# Altium project Power_Ctrl_Board.PrjPcb
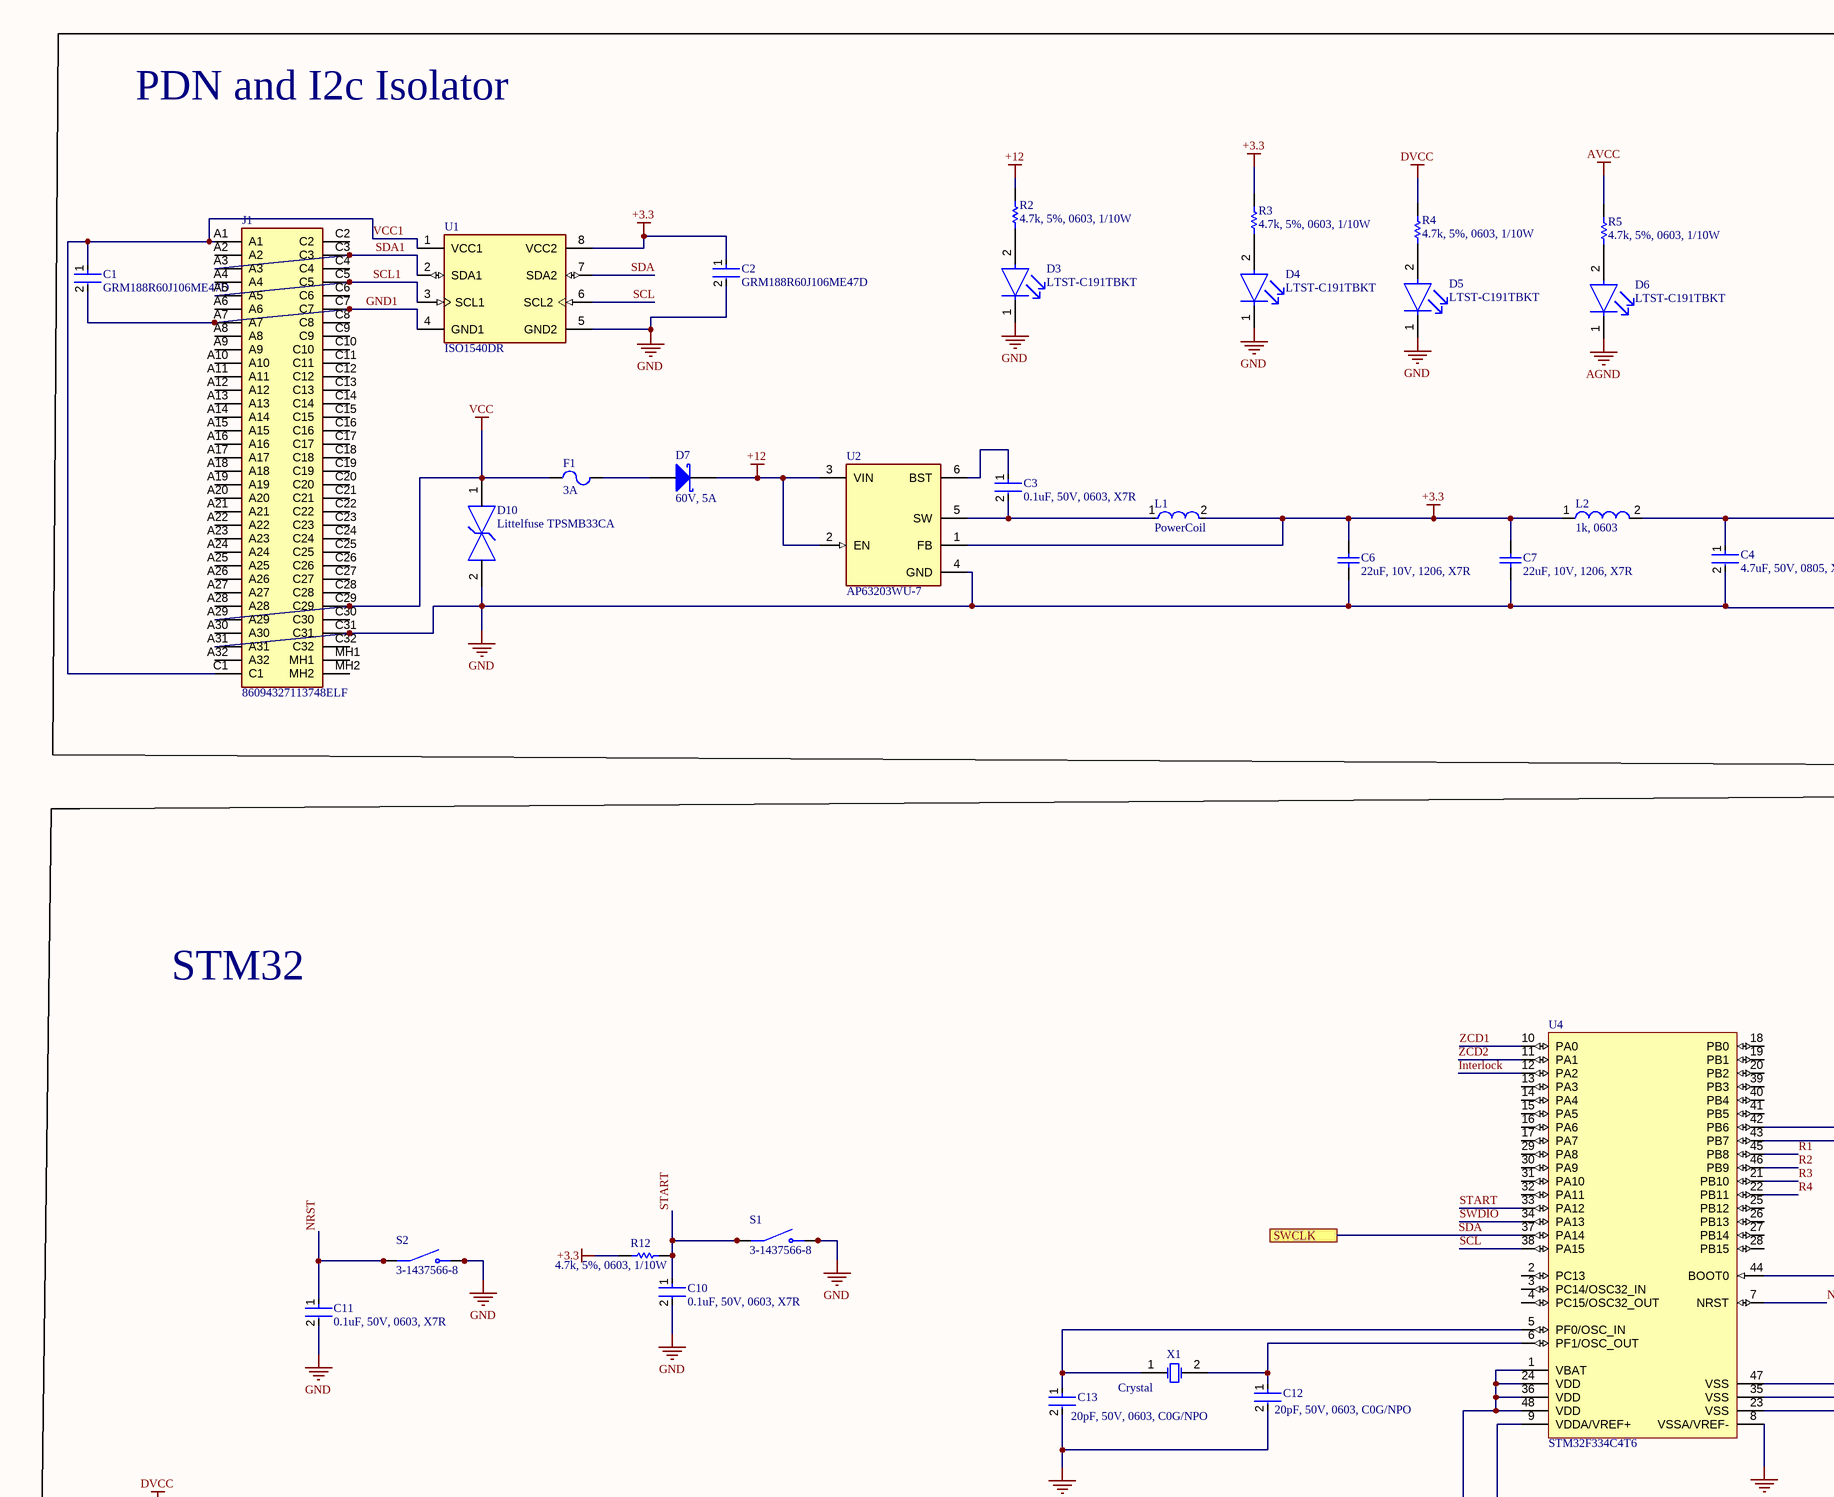
[diagram p0: Power_Ctrl_Board_SCH.SchDoc, top left]
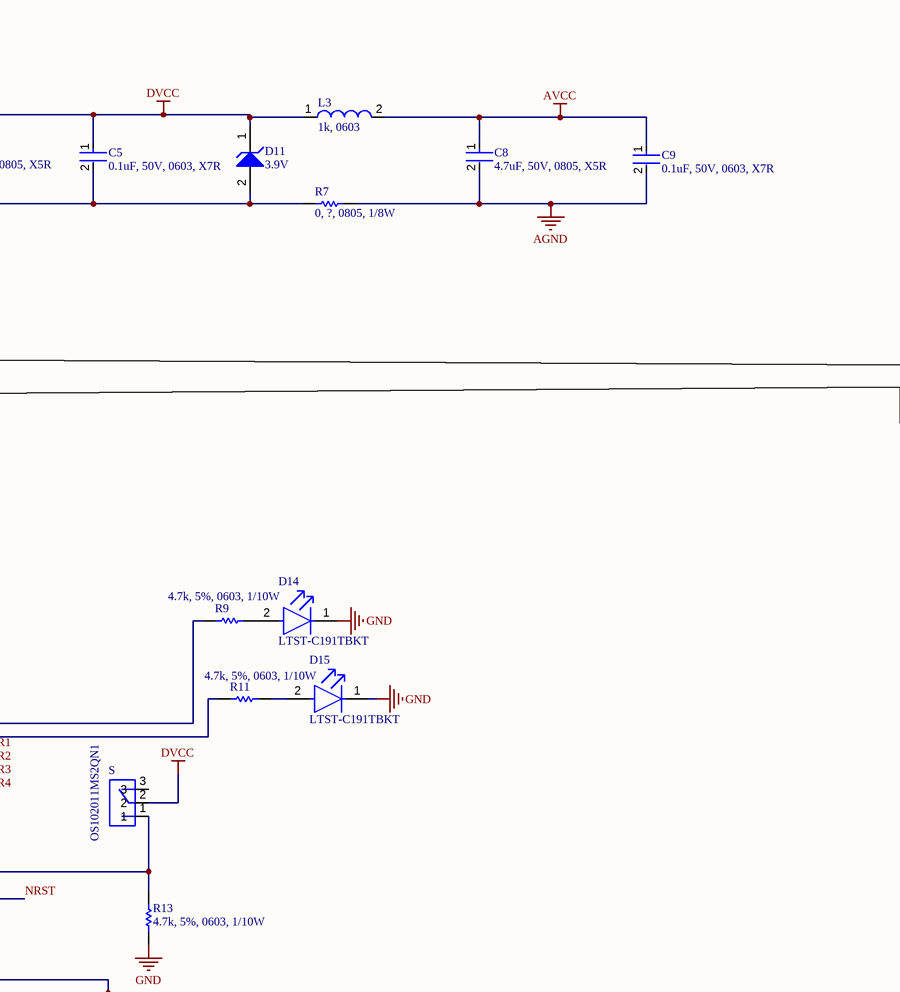
[diagram p1: Power_Ctrl_Board_SCH.SchDoc, top middle]
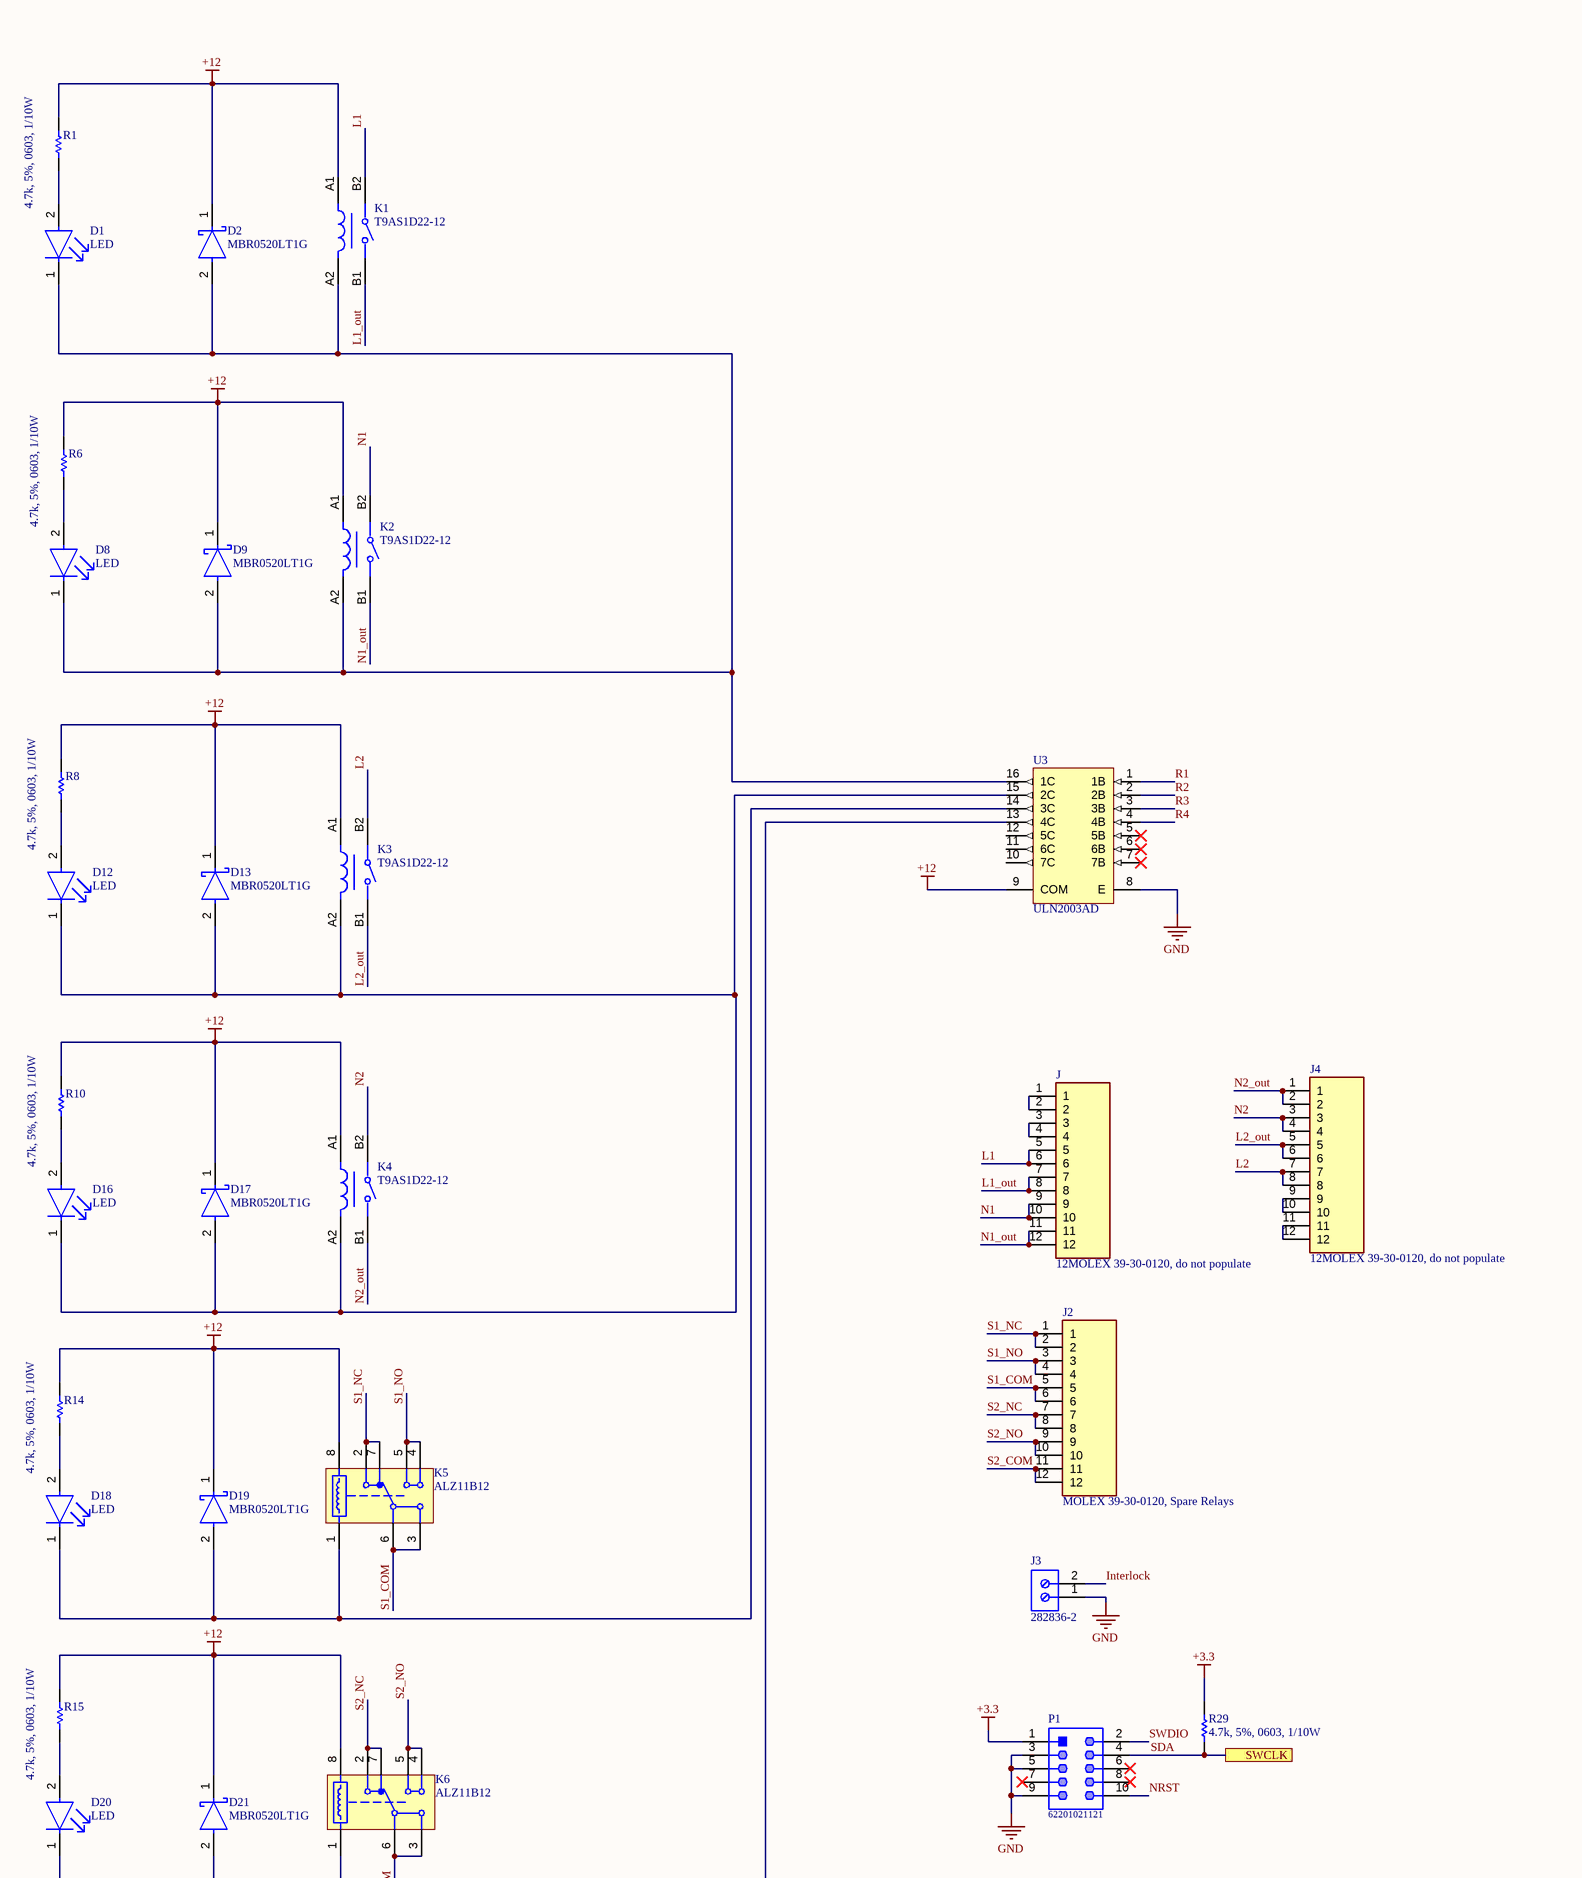
[diagram p2: Power_Ctrl_Board_SCH.SchDoc, top right]
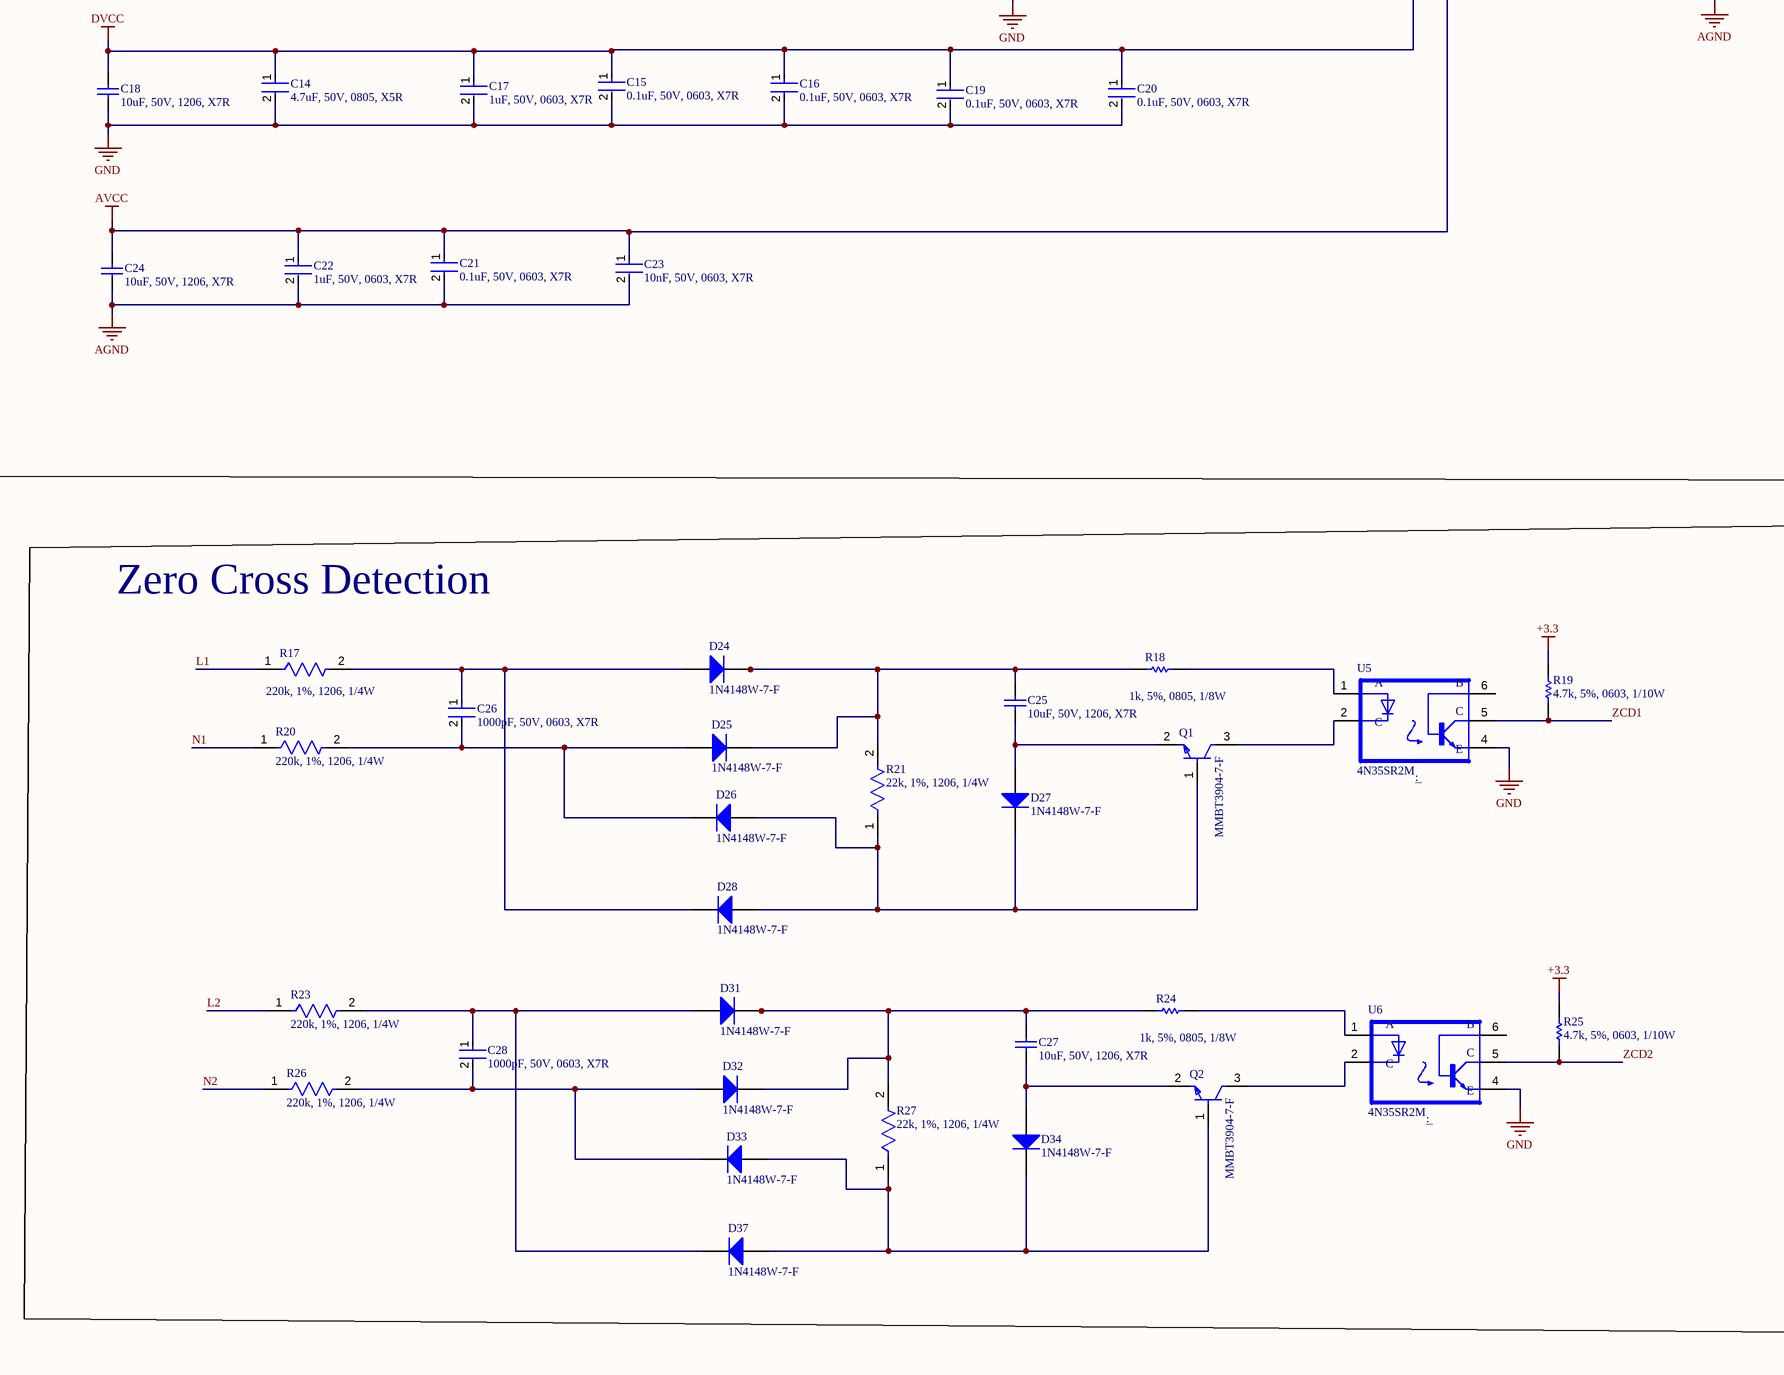
[diagram p3: Power_Ctrl_Board_SCH.SchDoc, bottom left]
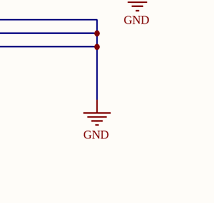
[diagram p4: Power_Ctrl_Board_SCH.SchDoc, bottom middle]
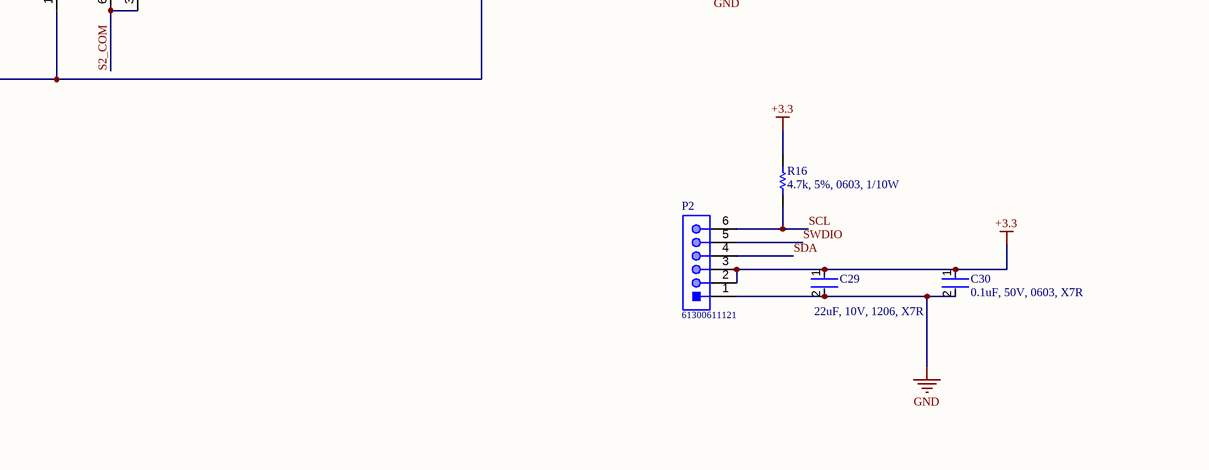
[diagram p5: Power_Ctrl_Board_SCH.SchDoc, bottom right]
1 sheet, 117 parts. Net scope: flat (ports and power ports of the same name join across sheets).
Board file: Power_Ctrl_Board_PCB.PcbDoc

## Sheet Power_Ctrl_Board_SCH.SchDoc
size 863 x 558 mm; SheetNumber: 1; SheetTotal: 1

### Parts
C1  GRM188R60J106ME47D  [FP-GRM188-0_1-e0_2_0_55-IPC_A]
C2  GRM188R60J106ME47D  [FP-GRM188-0_1-e0_2_0_55-IPC_A]
C3  0.1uF, 50V, 0603, X7R  [FP-GRM188-0_1-e0_2_0_55-IPC_A]
C4  4.7uF, 50V, 0805, X5R  [FP-C0805C-DG-MFG]
C5  0.1uF, 50V, 0603, X7R  [FP-GRM188-0_1-e0_2_0_55-IPC_A]
C6  22uF, 10V, 1206, X7R  [AVX-1206-2_L]
C7  22uF, 10V, 1206, X7R  [AVX-1206-2_L]
C8  4.7uF, 50V, 0805, X5R  [FP-C0805C-DG-MFG]
C9  0.1uF, 50V, 0603, X7R  [FP-GRM188-0_1-e0_2_0_55-IPC_A]
C10  0.1uF, 50V, 0603, X7R  [FP-GRM188-0_1-e0_2_0_55-IPC_A]
C11  0.1uF, 50V, 0603, X7R  [FP-GRM188-0_1-e0_2_0_55-IPC_A]
C12  20pF, 50V, 0603, C0G/NPO  [FP-GRM188-0_1-e0_2_0_55-IPC_A]
C13  20pF, 50V, 0603, C0G/NPO  [FP-GRM188-0_1-e0_2_0_55-IPC_A]
C14  4.7uF, 50V, 0805, X5R  [FP-C0805C-DG-MFG]
C15  0.1uF, 50V, 0603, X7R  [FP-GRM188-0_1-e0_2_0_55-IPC_A]
C16  0.1uF, 50V, 0603, X7R  [FP-GRM188-0_1-e0_2_0_55-IPC_A]
C17  1uF, 50V, 0603, X7R  [FP-GRM188-0_1-e0_2_0_55-IPC_A]
C18  10uF, 50V, 1206, X7R  [AVX-1206-2_L]
C19  0.1uF, 50V, 0603, X7R  [FP-GRM188-0_1-e0_2_0_55-IPC_A]
C20  0.1uF, 50V, 0603, X7R  [FP-GRM188-0_1-e0_2_0_55-IPC_A]
C21  0.1uF, 50V, 0603, X7R  [FP-GRM188-0_1-e0_2_0_55-IPC_A]
C22  1uF, 50V, 0603, X7R  [FP-GRM188-0_1-e0_2_0_55-IPC_A]
C23  10nF, 50V, 0603, X7R  [FP-GRM188-0_1-e0_2_0_55-IPC_A]
C24  10uF, 50V, 1206, X7R  [AVX-1206-2_L]
C25  10uF, 50V, 1206, X7R  [AVX-1206-2_L]
C26  1000pF, 50V, 0603, X7R  [FP-GRM188-0_1-e0_2_0_55-IPC_A]
C27  10uF, 50V, 1206, X7R  [AVX-1206-2_L]
C28  1000pF, 50V, 0603, X7R  [FP-GRM188-0_1-e0_2_0_55-IPC_A]
C29  22uF, 10V, 1206, X7R  [FP-GRM188-0_1-e0_2_0_55-IPC_A]
C30  0.1uF, 50V, 0603, X7R  [FP-GRM188-0_1-e0_2_0_55-IPC_A]
D1  LED  [FP-LTST-C191TBKT-MFG]
D2  MBR0520LT1G  [FP-425-04-IPC_C]
D3  LTST-C191TBKT  [FP-LTST-C191TBKT-MFG]
D4  LTST-C191TBKT  [FP-LTST-C191TBKT-MFG]
D5  LTST-C191TBKT  [FP-LTST-C191TBKT-MFG]
D6  LTST-C191TBKT  [FP-LTST-C191TBKT-MFG]
D7  60V, 5A  [NXP-SOD128_V]
D8  LED  [FP-LTST-C191TBKT-MFG]
D9  MBR0520LT1G  [FP-425-04-IPC_C]
D10  Littelfuse TPSMB33CA  [FP-SMAJ-CA-MFG]
D11  3.9V  [ONSC-SOD-123-2-425-04_V]
D12  LED  [FP-LTST-C191TBKT-MFG]
D13  MBR0520LT1G  [FP-425-04-IPC_C]
D14  LTST-C191TBKT  [FP-LTST-C191TBKT-MFG]
D15  LTST-C191TBKT  [FP-LTST-C191TBKT-MFG]
D16  LED  [FP-LTST-C191TBKT-MFG]
D17  MBR0520LT1G  [FP-425-04-IPC_C]
D18  LED  [FP-LTST-C191TBKT-MFG]
D19  MBR0520LT1G  [FP-425-04-IPC_C]
D20  LED  [FP-LTST-C191TBKT-MFG]
D21  MBR0520LT1G  [FP-425-04-IPC_C]
D24  1N4148W-7-F  [DIOD-SOD123-2_V]
D25  1N4148W-7-F  [DIOD-SOD123-2_V]
D26  1N4148W-7-F  [DIOD-SOD123-2_V]
D27  1N4148W-7-F  [DIOD-SOD123-2_V]
D28  1N4148W-7-F  [DIOD-SOD123-2_V]
D31  1N4148W-7-F  [DIOD-SOD123-2_V]
D32  1N4148W-7-F  [DIOD-SOD123-2_V]
D33  1N4148W-7-F  [DIOD-SOD123-2_V]
D34  1N4148W-7-F  [DIOD-SOD123-2_V]
D37  1N4148W-7-F  [DIOD-SOD123-2_V]
F1  3A  [LFUS-45X_V]
J  12MOLEX 39-30-0120, do not populate  [TE_1-1586038-2]
J1  86094327113748ELF  [86094327113748ELF]
J2  MOLEX 39-30-0120, Spare Relays  [TE_1-1586038-2]
J3  282836-2  [TECO-282836-2_V]
J4  12MOLEX 39-30-0120, do not populate  [TE_1-1586038-2]
K1  T9AS1D22-12  [FP-T9AS1D22-12-MFG]
K2  T9AS1D22-12  [FP-T9AS1D22-12-MFG]
K3  T9AS1D22-12  [FP-T9AS1D22-12-MFG]
K4  T9AS1D22-12  [FP-T9AS1D22-12-MFG]
K5  ALZ11B12  [PNSC-LZ-8-2880x1250x1570_V]
K6  ALZ11B12  [PNSC-LZ-8-2880x1250x1570_V]
L1  PowerCoil  [FP-NRS5030-H_3_0-MFG]
L2  1k, 0603  [SMD-0603]
L3  1k, 0603  [SMD-0603]
P1  62201021121  [62201021121]
P2  61300611121  [61300611121]
Q1  MMBT3904-7-F  [FP-SOT23-IPC_A]
Q2  MMBT3904-7-F  [FP-SOT23-IPC_A]
R1  4.7k, 5%, 0603, 1/10W  [RESC1609X55X30LL15T15]
R2  4.7k, 5%, 0603, 1/10W  [RESC1609X55X30LL15T15]
R3  4.7k, 5%, 0603, 1/10W  [RESC1609X55X30LL15T15]
R4  4.7k, 5%, 0603, 1/10W  [RESC1609X55X30LL15T15]
R5  4.7k, 5%, 0603, 1/10W  [RESC1609X55X30LL15T15]
R6  4.7k, 5%, 0603, 1/10W  [RESC1609X55X30LL15T15]
R7  0, ?, 0805, 1/8W  [RESC2013X50X30LL20T20]
R8  4.7k, 5%, 0603, 1/10W  [RESC1609X55X30LL15T15]
R9  4.7k, 5%, 0603, 1/10W  [RESC1609X55X30LL15T15]
R10  4.7k, 5%, 0603, 1/10W  [RESC1609X55X30LL15T15]
R11  4.7k, 5%, 0603, 1/10W  [RESC1609X55X30LL15T15]
R12  4.7k, 5%, 0603, 1/10W  [RESC1609X55X30LL15T15]
R13  4.7k, 5%, 0603, 1/10W  [RESC1609X55X30LL15T15]
R14  4.7k, 5%, 0603, 1/10W  [RESC1609X55X30LL15T15]
R15  4.7k, 5%, 0603, 1/10W  [RESC1609X55X30LL15T15]
R16  4.7k, 5%, 0603, 1/10W  [RESC1609X55X30LL15T15]
R17  220k, 1%, 1206, 1/4W  [FP-RC1206-MFG]
R18  1k, 5%, 0805, 1/8W  [RESC2013X50X30LL20T20]
R19  4.7k, 5%, 0603, 1/10W  [RESC1609X55X30LL15T15]
R20  220k, 1%, 1206, 1/4W  [FP-RC1206-MFG]
R21  22k, 1%, 1206, 1/4W  [FP-RC1206-MFG]
R23  220k, 1%, 1206, 1/4W  [FP-RC1206-MFG]
R24  1k, 5%, 0805, 1/8W  [RESC2013X50X30LL20T20]
R25  4.7k, 5%, 0603, 1/10W  [RESC1609X55X30LL15T15]
R26  220k, 1%, 1206, 1/4W  [FP-RC1206-MFG]
R27  22k, 1%, 1206, 1/4W  [FP-RC1206-MFG]
R29  4.7k, 5%, 0603, 1/10W  [RESC1609X55X30LL15T15]
S  OS102011MS2QN1  [SW_OS102011MS2QN1]
S1  3-1437566-8  [SW_3-1437566-8]
S2  3-1437566-8  [SW_3-1437566-8]
U1  ISO1540DR  [FP-D0008A-MFG]
U2  AP63203WU-7  [FP-TSOT26-MFG]
U3  ULN2003AD  [D0016A_M]
U4  STM32F334C4T6  [STM-LQFP48_M]
U5  4N35SR2M  [OPTO_4N35SM]
U6  4N35SR2M  [OPTO_4N35SM]
X1  Crystal  [ABRA-ABLS2-2_V]

### Blocks framed on the sheet
PDN and I2c Isolator: C1-C9 D3-D7 D10 D11 F1 J1 L1-L3 R2-R5 R7 U1 U2
STM32: C10-C24 D14 D15 R9 R11-R13 S S1 S2 U4 X1
Zero Cross Detection: C25-C28 D24-D28 D31-D34 D37 Q1 Q2 R17-R21 R23-R27 U5 U6

### Ports
SWCLK

### Nets
+3.3: C2.1 C6.2 C7.2 C29.1 C30.1 L1.2 L2.1 P1.1 P2.2 P2.3 R3.2 R12.2 R16.2 R19.2 R25.2 R29.2 U1.8(VCC2) U2.1(FB)
+12: D2.1(C) D7.2(K) D9.1(C) D13.1(C) D17.1(C) D19.1(C) D21.1(C) K1.A1 K2.A1 K3.A1 K4.A1 K5.8 K6.8 R1.2 R2.2 R6.2 R8.2 R10.2 R14.2 R15.2 U2.2(EN) U2.3(VIN) U3.9(COM)
AGND: C8.2 C9.2 C21.2 C22.2 C23.2 C24.1 D6.1(C) R7.2 U4.8(VSSA/VREF-)
AVCC: C8.1 C9.1 C21.1 C22.1 C23.1 C24.2 L3.2 R5.2 U4.9(VDDA/VREF+)
DVCC: C4.1 C5.1 C14.1 C15.1 C16.1 C17.1 C18.2 C19.1 C20.1 D11.1(K) L2.2 L3.1 R4.2 S.2 U4.1(VBAT) U4.24(VDD) U4.36(VDD) U4.48(VDD)
GND: C2.2 C4.2 C5.2 C6.1 C7.1 C10.2 C11.2 C12.2 C13.2 C14.2 C15.2 C16.2 C17.2 C18.1 C19.2 C20.2 C29.2 C30.2 D3.1(C) D4.1(C) D5.1(C) D10.2 D11.2(A) D14.1(C) D15.1(C) J1.A31 J1.C31 J3.1 P1.3 P1.5 P1.9 P2.1 R7.1 R13.1 S1.3(NO) S1.4(NO) S2.3(NO) S2.4(NO) U1.5(GND2) U2.4(GND) U3.8(E) U4.23(VSS) U4.35(VSS) U4.47(VSS) U5.4(E) U6.4(E)
VCC: D10.1 F1.1 J1.A29 J1.C29
GND1: C1.2 J1.A7 J1.C7 U1.4(GND1)
Interlock: J3.2 U4.12(PA2)
L1: J.5 J.6 K1.B2 R17.1
L1_out: J.7 J.8 K1.B1
L2: J4.7 J4.8 K3.B2 R23.1
L2_out: J4.5 J4.6 K3.B1
N1: J.9 J.10 K2.B2 R20.1
N1_out: J.11 J.12 K2.B1
N2: J4.3 J4.4 K4.B2 R26.1
N2_out: J4.1 J4.2 K4.B1
NRST: C11.1 P1.10 S2.1(COM) S2.2(COM) U4.7(NRST)
R1: U3.1(1B) U4.45(PB8)
R2: U3.2(2B) U4.46(PB9)
R3: U3.3(3B) U4.21(PB10)
R4: U3.4(4B) U4.22(PB11)
S1_COM: J2.5 J2.6 K5.3 K5.6
S1_NC: J2.1 J2.2 K5.2 K5.7
S1_NO: J2.3 J2.4 K5.4 K5.5
S2_COM: J2.11 J2.12 K6.3 K6.6
S2_NC: J2.7 J2.8 K6.2 K6.7
S2_NO: J2.9 J2.10 K6.4 K6.5
SCL: P2.6 R16.1 U1.6(SCL2) U4.38(PA15)
SCL1: J1.A5 J1.C5 U1.3(SCL1)
SDA: P1.4 P2.4 R29.1 U1.7(SDA2) U4.37(PA14) ; port SWCLK
SDA1: J1.A3 J1.C3 U1.2(SDA1)
START: C10.1 R12.1 S1.1(COM) S1.2(COM) U4.33(PA12)
SWDIO: P1.2 P2.5 U4.34(PA13)
VCC1: C1.1 J1.A1 J1.C1 U1.1(VCC1)
ZCD1: R19.1 U4.10(PA0) U5.5(CO)
ZCD2: R25.1 U4.11(PA1) U6.5(CO)
NetC3_1: C3.1 U2.6(BST)
NetC3_2: C3.2 L1.1 U2.5(SW)
NetC12_1: C12.1 U4.6(PF1/OSC_OUT) X1.2(X2)
NetC13_1: C13.1 U4.5(PF0/OSC_IN) X1.1(X1)
NetC25_1: C25.1 D27.1(A) Q1.2(E)
NetC25_2: C25.2 D24.2(K) D25.2(K) R18.1 R21.2
NetC26_1: C26.1 D24.1(A) D28.2(K) R17.2
NetC26_2: C26.2 D25.1(A) D26.2(K) R20.2
NetC27_1: C27.1 D34.1(A) Q2.2(E)
NetC27_2: C27.2 D31.2(K) D32.2(K) R24.1 R27.2
NetC28_1: C28.1 D31.1(A) D37.2(K) R23.2
NetC28_2: C28.2 D32.1(A) D33.2(K) R26.2
NetD1_1: D1.1(C) D2.2(A) D8.1(C) D9.2(A) K1.A2 K2.A2 U3.16(1C)
NetD1_2: D1.2(A) R1.1
NetD3_2: D3.2(A) R2.1
NetD4_2: D4.2(A) R3.1
NetD5_2: D5.2(A) R4.1
NetD6_2: D6.2(A) R5.1
NetD7_1: D7.1(A) F1.2
NetD8_2: D8.2(A) R6.1
NetD12_1: D12.1(C) D13.2(A) D16.1(C) D17.2(A) K3.A2 K4.A2 U3.15(2C)
NetD12_2: D12.2(A) R8.1
NetD14_2: D14.2(A) R9.1
NetD15_2: D15.2(A) R11.1
NetD16_2: D16.2(A) R10.1
NetD18_1: D18.1(C) D19.2(A) K5.1 U3.14(3C)
NetD18_2: D18.2(A) R14.1
NetD20_1: D20.1(C) D21.2(A) K6.1 U3.13(4C)
NetD20_2: D20.2(A) R15.1
NetD26_1: D26.1(A) D27.2(K) D28.1(A) Q1.1(B) R21.1
NetD33_1: D33.1(A) D34.2(K) D37.1(A) Q2.1(B) R27.1
NetJ4_9: J4.9 J4.10
NetJ4_11: J4.11 J4.12
NetJ_1: J.1 J.2
NetJ_3: J.3 J.4
NetQ1_3: Q1.3(C) U5.2(C)
NetQ2_3: Q2.3(C) U6.2(C)
NetR9_2: R9.2 U4.42(PB6)
NetR11_2: R11.2 U4.43(PB7)
NetR13_2: R13.2 S.1 U4.44(BOOT0)
NetR18_2: R18.2 U5.1(A)
NetR24_2: R24.2 U6.1(A)

Not connected (* = marked no-connect by the designer): J1 A2 A4 A6 A8 A9 A10 A11 A12 A13 A14 A15 A16 A17 A18 A19 A20 A21 A22 A23 A24 A25 A26 A27 A28 A30 A32 C2 C4 C6 C8 C9 C10 C11 C12 C13 C14 C15 C16 C17 C18 C19 C20 C21 C22 C23 C24 C25 C26 C27 C28 C30 C32 MH1 MH2; P1 6* 7* 8*; S 3; U3 5(5B)* 6(6B)* 7(7B)* 10(7C) 11(6C) 12(5C); U4 2(PC13) 3(PC14/OSC32_IN) 4(PC15/OSC32_OUT) 13(PA3) 14(PA4) 15(PA5) 16(PA6) 17(PA7) 18(PB0) 19(PB1) 20(PB2) 25(PB12) 26(PB13) 27(PB14) 28(PB15) 29(PA8) 30(PA9) 31(PA10) 32(PA11) 39(PB3) 40(PB4) 41(PB5); U5 6(B); U6 6(B)

### Notes on the sheet
- DWG. NO.
- REV.
- SHT.
- REVISION
- DESCRIPTION
- DATE
- APPROVED
- THIS DOCUMENT AND THE DATA DISCLOSED HEREIN OR HEREWITH IS THE PROPERTY OF ALTIUM LIMITED AND MAY BE FREELY DISTRIBUTED IN WHOLE. NO RIGHTS ARE RESERVED OR EXPRESS OR IMPLIED WARANTEE GIVEN.
- ENG:
- DSN:
- APPROVALS
- PROJECT
- DOCUMENT REVISION:
- DESIGN ITEM:
- CHK:
- BOM:
- REFERENCE DOCUMENTS
- PROJECT REVISION:
- TITLE
- FAB DWG:
- PCB DWG:
- ASSY DWG:
- SCALE:
- SIZE
- D
- CAGE CODE
- FILE NAME
- DWG NO.
- SHEET
- OF
- REV

### Library data of the parts
C1-C3 C5 C9-C13 C15-C17 C19-C23 C26 C28-C30 = CMP-2006-02792-2: Chip Multilayer Ceramic Capacitors for General Purpose, 0603, 10uF, X5R, 15%, 20%, 6.3V; Packaging: Tape and Reel; Voltage Rating (DC): 6.3V; Width: 0.031inch; Termination: SMD/SMT; Dielectric: X5R; Package Quantity: 4000; Voltage Rating: 6.3V; Capacitance: 10uF; Case/Package: 0603; Min Operating Temperature: -55°C; Voltage: 6.3V; Length: 1.6mm; Thickness: 0.035inch; Lead Free: Lead Free; Depth: 0.8mm; Case Code (Imperial): 0603; Max Operating Temperature: 85°C; Material: Ceramic; Height: 0.8mm; Tolerance: 20%; Mount: Surface Mount; REACH SVHC: No SVHC; Radiation Hardening: No; Case Code (Metric): 1608
C4 C8 C14 = CMP-2007-03243-2: CAP CER 10UF 10V X5R 0805; Manufacturer Part Number: C0805C106K8PACTU; Manufacturer: Kemet; 3DS Part Number: 220-00001; Tolerance: 10%; Temperature Coefficient: 15%; Material: Ceramic; Device Class L2: Capacitors; Device Class L1: Passive Components; ComponentLink2URL: https://content.kemet.com/datasheets/KEM_C1006_X5R_SMD.pdf; Height: 1.4mm; Lead Free: Yes; Digikey Description: CAP CER 10UF 10V X5R 0805; Octopart: https://octopart.com/c0805c106k8pactu-kemet-98697; Capacitance: 10uF; Value: 10uF; Temperature Range Low: -55°C; Temperature: -55°C to +85°C; Automotive: No; Mouser Description: CAP CER 10UF 10V X5R 0805; Ipc Land Pattern Name: CAPC200125X125; Temperature Range High: +85°C; Voltage: 10V; RoHS: TRUE; Device Class L3: Ceramic Capacitors; ComponentLink2Description: Datasheet; Voltage Rating: 10V; Package: C0805C-DG; Temperature Characteristic: X5R; Category: Cap
C6 C7 C18 C24 C25 C27 = CMP-2000-05468-1: Chip Capacitor, 1 nF, +/- 10%, -55 to 125 degC, 1206 (3216 Metric), RoHS, Tape and Reel; PartNumber: 1206GC102KAT1A; Manufacturer: AVX; Capacitance: 0.001uF; Voltage Rating DC: 2000V; Package Reference: 1206; Dielectric: X7R; Datasheet Version: 11/2010; Mounting Technology: SurfaceMount; Manufacturer URL: http://www.avx.com/; Tolerance: 10%; Tolerance (%): ±10%; Datasheet URL: https://datasheet.ciiva.com/11787/0900766b80ed4c37-11787781.pdf; Package Description: 2-Pin SMD, Body 3.4 x 1.8 mm; Case Size/Dimension: 1206; Rated Voltage: 2000V
D1 D3-D6 D8 D12 D14-D16 D18 D20 = CMP-22017-000008-1: LED BLUE CLEAR CHIP SMD; Lens Color: Colorless; Dominant Wavelength: 475nm; Forward Current: 20mA; Wavelength: 468nm; Viewing Angle: 130°; Power Dissipation: 76mW; Luminous Intensity: 180mcd; Reverse Voltage: 5V; Number of Elements: 1; Lens Style: Diffused; Forward Voltage: 3.8V; Max Power Dissipation: 75mW; Case Code (Metric): 1608; Packaging: Tape and Reel; Case/Package: 0603; Depth: 1.6mm; Mount: Surface Mount; Lead Free: Lead Free; Min Operating Temperature: -20°C; Lens Transparency: Clear; Illumination Color: Blue; Height: 0.55mm; Test Current: 20mA; Case Code (Imperial): 0603; Max Operating Temperature: 80°C; Number of Pins: 2; Length: 0.8mm; Radiation Hardening: No; Package Quantity: 1; Number of LEDs: 1; Width: 0.8mm; Color: Blue
D2 D9 D13 D17 D19 D21 = CMP-1055-00425-2: DIODE SCHOTTKY 20V 500MA SOD123; Polarity: Standard; Peak Non-Repetitive Surge Current: 5.5A; Forward Voltage: 385mV; Element Configuration: Single; Peak Reverse Current: 250uA; Max Repetitive Reverse Voltage (Vrrm): 20V; Voltage Rating (DC): 20V; Case/Package: SOD-123-2; Number of Pins: 2; Output Current: 500mA; Min Operating Temperature: -65°C; Lead Free: Lead Free; REACH SVHC: No SVHC; Max Reverse Voltage (DC): 20V; Termination: SMD/SMT; Average Rectified Current: 500mA; Max Surge Current: 5.5A; Package Quantity: 3000; Height: 1.12mm; Current Rating: 500mA; Forward Current: 500mA; Max Forward Surge Current (Ifsm): 5.5A; Packaging: Tape and Reel; Length: 2.69mm; Radiation Hardening: No; Max Reverse Leakage Current: 250uA; Width: 1.6mm; Contact Plating: Tin; Max Operating Temperature: 125°C
D7 = CMP-2000-06906-1: Schottky Barrier Rectifier, 3 A, 30 V, -55 to 150 degC, 2-Pin SOD128, RoHS, Tape and Reel; Manufacturer: NXP Semiconductors; Other Names: 568-6761-6; Package Version: 02/2016; Capacitance @ Vr, F: 470pF@1V,1MHz; PCN Packaging: LighterReels02/Jan/2014; Speed: FastRecovery=200mA(Io); Current - Average Rectified (Io): 3A; Current - Reverse Leakage @ Vr: 5mA@30V; Voltage - DC Reverse (Vr) (Max): 30V; Online Catalog: SchottkyDiode; Voltage - Forward (Vf) (Max) @ If: 360mV@3A; Datasheet Version: Rev. 01, 12/2009; Mounting Type: SurfaceMount; Packaging: Digi-Reel®; Package URL: http://www.nxp.com/documents/outline_drawing/SOD128.pdf; Series: -; Package / Case: SOD-128; Supplier Device Package: SOD-128; Package Reference: SOD128; Manufacturer URL: http://www.nxp.com/; Operating Temperature - Junction: 150°C(Max); Family: Diodes,Rectifiers-Single; Standard Package: 1; Reverse Recovery Time (trr): -; Diode Type: Schottky; Mounting Technology: SurfaceMount; Category: DiscreteSemiconductorProducts; Package Description: 2-Pin Plastic Surface-Mounted Package, Body 2.5 x 3.8 mm; Datasheet URL: http://www.nxp.com/documents/data_sheet/PMEG3030EP.pdf
D10 = CMP-08607-000027-1: TVS DIODE 12V 19.9V DO214AC; Manufacturer Part Number: SMAJ12CA; Manufacturer: Littelfuse Inc; Peak Pulse Power: 400W; Direction: Bidirectional; Breakdown Voltage: 13.3V; Peak Pulse Current: 20.1A; Number Of Channels: 1; Max Junction Temp: +150°C; Digikey Description: TVS DIODE 12V 19.9V DO214AC; Lead Free: Yes; Temperature Range High: +150°C; Clamping Voltage: 19.9V; Mouser Description: TVS Diodes - Transient Voltage Suppressors 12Vr 400W 20.1A 5% BiDirectional; Reverse Standoff Voltage: 12V; Device Class L3: unset; ComponentLink2URL: https://www.littelfuse.com/~/media/electronics/datasheets/tvs_diodes/littelfuse_tvs_diode_smaj_datasheet.pdf.pdf; Category: Diode; Device Class L1: Circuit Protection; Package: SMAJ-CA; Octopart: https://octopart.com/smaj12ca-littelfuse-349824; Temperature: -65°C to +150°C; Height: 2.29mm; Temperature Range Low: -65°C; RoHS: TRUE; Device Class L2: TVS Diodes; ComponentLink2Description: Datasheet; Automotive: No
D11 = CMP-1060-00279-1: Zener Voltage Regulator, 500 mW, 2-Pin SOD-123, Pb-Free, Tape and Reel; PartNumber: MMSZ18T1G; Manufacturer: On Semiconductor; P Max (W): 0.5; Mounting Technology: Surface Mount; RoHS: Pb-Free; ComponentLink1URL: http://www.onsemi.com/; PackageDescription: 2-Pin SOD, Body 1.6 x 2.69 mm; ComponentLink1Description: Manufacturer URL; ComponentLink3Description: Package Specification; ComponentLink3URL: http://www.onsemi.com/pub_link/Collateral/425-04.PDF; PackageVersion: Rev. G, 10/2009; Packing: Tape and Reel; ComponentLink2Description: Datasheet; PackageReference: SOD-123-2-425-04; ComponentLink2URL: http://www.onsemi.com/pub_link/Collateral/MMSZ2V4T1-D.PDF; DatasheetVersion: Rev. 11
D24-D28 D31-D34 D37 = CMP-2000-04932-2: Fast Switching Diode, 100 V, 0.15 A, -65 to 150 degC, 2-Pin?SOD123, RoHS, Tape and Reel; Recovery Time: 4ns; Brand: DiodesIncorporated; Unit Weight: 0.000353oz; Max Surge Current: 2A; Peak Reverse Voltage: 100V; Ir - Reverse Current: 1uA; Vf - Forward Voltage: 1.25V; Configuration: Single; If - Forward Current: 0.15A; Product Category: Diodes-GeneralPurpose,Power,Switching; Operating Temperature Range: -65Cto+150C; Packaging: Reel; Manufacturer URL: http://www.diodes.com/; Maximum Operating Temperature: +150C; Height: 1.25mm; Minimum Operating Temperature: -65C; Product: SwitchingDiodes; Package URL: http://www.diodes.com/datasheets/ds18004.pdf; Type: SwitchingDiode; Package Reference: SOD123-2; Width: 1.7mm; Datasheet URL: http://www.farnell.com/datasheets/1915529.pdf; Datasheet Version: Rev. 24-2, 10/2013; Series: 1N4148; Factory Pack Quantity: 3000; Length: 2.85mm; RoHS: True; Manufacturer: DiodesIncorporated; Mounting Style: SMD/SMT; Package / Case: SOD-123
F1 = CMP-2000-05631-1: Fuse, 125 V, 500 mA, -55 to 125 degC, 2-Pin SMD, RoHS, Tape and Reel; Manufacturer: Littelfuse; Working Voltage-Max: 125V; Response Characteristic: VeryFastActing; Current Rating: 0.5A; Datasheet Version: 02/2016; Package Description: 2-Pin Surface Mount Device, Body 6.1 x 2.69 mm; Package Reference: 45X; Manufacturer URL: http://www.littelfuse.com/; Mounting Technology: SurfaceMount; Size: 6.10x2.69mm; Operating Temp Range: -55to+125°C; Datasheet URL: http://www.littelfuse.com/products/fuses/surface-mount-fuses/nano-2-fuses/~/media/electronics/datasheets/fuses/littelfuse_fuse_451_453_datasheet.pdf.pdf
J J2 J4 = 1-1586038-2: Conn Power HDR 12 POS 4.2mm Solder ST Thru-Hole 12 Terminal 1 Port Tray; MF: TE Connectivity; Price: None; Availability: Unavailable; Value: *; MP: 1-1586038-2; Package: None; SnapEDA_Link: https://www.snapeda.com/parts/1-1586038-2/TE%20Connectivity%20AMP%20Connectors/view-part/2360872/?ref=snap
J1 = 86094327113748ELF: Connector; Manufacturer_Name: Amphenol; Datasheet Link: https://cdn.amphenol-icc.com/media/wysiwyg/files/drawing/c-8609-2154.pdf; Height: 11.1mm; Manufacturer_Part_Number: 86094327113748ELF; Mouser Part Number: 649-869432713748ELF; Mouser Price/Stock: https://www.mouser.co.uk/ProductDetail/Amphenol-FCI/86094327113748ELF?qs=isxS6NDG2Tvinl2bB1GBQA%3D%3D
J3 = CMP-1684-00017-1: Female Header, Pitch 5 mm, 1 x 2 Position, Height 10 mm, Tail Length 3.5 mm, Rohs, Bulk; Manufacturer: TE Connectivity; Wire Gauge: 16-30AWG; Product Training Modules: Wire-to-BoardEurostyleTerminalBlocks; Clamp Material - Plating: Brass-NickelPlated; Voltage: 300V; Mating Orientation: HorizontalwithBoard; Current: 13.5A; Pitch: 0.197"(5.00mm); Screw Thread: M3; 3D Model: 282836-2.pdf; Other Names: 5ULV-02B / A98076; Dynamic Catalog: BuchananSeries; Number of Levels: 1; Torque - Screw: 0.68Nm(6Lb-In); Featured Product: EurostyleTerminalBlockConnectors; Positions Per Level: 2; Wire Termination: Screw-RisingCageClamp; Datasheet URL: http://www.te.com.cn/commerce/DocumentDelivery/DDEController?Action=showdoc&DocId=Catalog+Section%7F1308389_EUROSTYLE_TERMINAL_BLOCKS%7F0607%7Fpdf%7FEnglish%7FENG_CS_1308389_EUROSTYLE_TERMINAL_BLOCKS_0607.pdf%7F282836-2; Color: Green; Family: TerminalBlocks-WiretoBoard; RoHS Information: 282836-2StatementofCompliance; Standard Package: 300; Contact Material - Plating: Brass-TinPlated; Manufacturer URL: http://www.te.com; Housing Material: Polyamide(PA66),Nylon6/6; Features: Interlocking(Side); Package Description: Female Header, Pitch 5 mm, 1 x 2 Position, Height 10 mm, Tail Length 3.5 mm; Mounting Type: ThroughHole; Package Reference: THD; Packaging: Bulk; Series: Buchanan; Category: Connectors,Interconnects; Screw Material - Plating: Brass-NickelPlated
K1-K4 = CMP-03395-000121-1: RELAY GEN PURPOSE SPST 30A 12V; Manufacturer: TE Connectivity; Coil Type: Non-Latching; Number Of Contacts: 1; Coil Resistance: 144Ω; Coil Power: 1W; Lead Free: Yes; Coil Voltage: 12V; Throw Configuration: SPST; Automotive: No; Temperature Range Low: -55°C; Ambient Temperature Range Low: -55°C; Category: Relay; Digikey Description: RELAY GEN PURPOSE SPST 30A 12V; RoHS: TRUE; ComponentLink2Description: Datasheet; Device Class L1: Electromechanical; Current Rating: 30A; Manufacturer Part Number: T9AS1D22-12; Device Class L2: Relays; Device Class L3: Power Relays; Octopart: https://octopart.com/t9as1d22-12-te+connectivity-46521723; Height: 27.94mm; Temperature Range High: +105°C; Temperature: -55°C to +105°C; Ambient Temperature Range High: +85°C; Package: T9AS1D22-12; ComponentLink2URL: https://www.te.com/commerce/DocumentDelivery/DDEController?Action=showdoc&DocId=Customer+Drawing%7FT9AS1D22-12%7FG%7Fpdf%7FEnglish%7FENG_CD_T9AS1D22-12_G.pdf%7F1-1419104-7; Switching Current: 30A
K5 K6 = CMP-1503-00243-1: LZ Relays, 12 V Coil Voltage, 400 mW Nominal Operating Power, -40 to 85 degC, 8-Pin LZ, Carton, Case, RoHS; Manufacturer: Panasonic; Max Switching Current: 16 A; Nominal Operating Power: 400 mW; Pb-Free: True; Electrical Life: 1x10^5 (N.O.), 5x10^4 (N.C.); Coil Voltage: 12 V; Mechanical Life(Min.operation): 1x10^7; Max Switching Voltage: 440 V AC; PartNumber: ALZ11B12; PackageReference: LZ-8-2880x1250x1570; RoHS: True; Packing: Carton, Case; PackageDescription: 8-Pin Through Hole Terminal Package, Body 28.8 x 12.5 mm; PackageVersion: ASCTB203E, 02/2014; ComponentLink2URL: http://www3.panasonic.biz/ac/e_download/control/relay/power/catalog/mech_eng_lz.pdf?f_cd=300372; ComponentLink2Description: Datasheet; Series: LZ Relays; ComponentLink3Description: Package Specification; ComponentLink1URL: http://www3.panasonic.biz/ac/ae/index.jsp; DatasheetVersion: 201402-T; ComponentLink1Description: Manufacturer URL; Mounting Technology: Through Hole; ComponentLink3URL: http://www3.panasonic.biz/ac/e_download/control/relay/power/catalog/mech_eng_lz.pdf?f_cd=300372
L1 = CMP-14484-000032-1: FIXED IND 15UH 1.4A 125 MOHM SMD; Saturation Current: 1.6A; Self Resonant Frequency: 14MHz; Test Frequency: 100kHz; Tolerance: 20%; Shielding: Shielded; DC Resistance (DCR): 125mR; Core Material: Ferrite; Case/Package: 5030; Inductance: 15uH; Radiation Hardening: No; Packaging: Tape and Reel; Current Rating: 1.4A; Width: 0.193inch; Height: 3mm; Min Operating Temperature: -25°C; Height - Seated (Max): 0.118inch; Max Operating Temperature: 120°C; Halogen Free: Halogen Free; Mount: Surface Mount; RoHS Compliant: Yes; Length: 0.193inch; Termination: SMD/SMT; Max DC Current: 1.6A; Package Quantity: 1; Depth: 4.9mm
L2 L3 = CMP-0220-00185-1: SMD EMI Suppression Ferrite Bead WE-CBF, Z = 30 Ohm; Impedance: 30 Ohm; PackageReference: SMD-0603; ComponentLink2Description: Datasheet; ComponentLink1URL: http://www.we-online.com; PackageDescription: Chip Inductor, 2-Leads, Body 1.6 x 0.8 mm; ComponentLink1Description: Manufacturer Link; PackageVersion: 2009; ComponentLink2URL: http://www.we-online.de/katalog/media/pdf/742792601.pdf; DatasheetVersion: Dec-2005
P1 = CMP-1502-00948-1: THT Vertical Pin Header WR-PHD, Pitch 1.27 mm, Dual Row, 10 pins; Manufacturer: Wurth Elektronik; Rated Current: 1A; Pin Number: 10; Working Voltage: 100VAC; Contact Resistance: 20mOhm; Withstanding Voltage: 500VAC; Pitch: 1.27mm; Gender: Male; Mounting Technology: THT; Manufacturer URL: http://www.we-online.de; Package Reference: 62201021121; Row Number: Dual; Datasheet URL: https://katalog.we-online.de/em/datasheet/62201021121.pdf; Publisher: WurthElektronik; Packaging: Box; Operating Temperature: -40to105degC; Orientation: Vertical; Part Number: 62201021121
P2 = CMP-1502-01070-1: THT Vertical Pin Header WR-PHD, Pitch 2.54 mm, Single Row, 6 pins; Manufacturer: Wurth Elektronik; Gender: Male; Pin Number: 6; Pitch: 2.54mm; Working Voltage: 250VAC; Rated Current: 3A; Withstanding Voltage: 500VAC; Contact Resistance: 20mOhm; Operating Temperature: -40to105degC; Packaging: Bag; Datasheet URL: https://katalog.we-online.de/em/datasheet/6130xx11121.pdf; Package Reference: 61300611121; Mounting Technology: THT; Publisher: WurthElektronik; Part Number: 61300611121; Manufacturer URL: http://www.we-online.de; Row Number: Single; Orientation: Vertical
Q1 Q2 = CMP-2000-04931-2: TRANS NPN 40V 0.2A SMD SOT23-3; Frequency: 300MHz; Power Dissipation: 350mW; Element Configuration: Single; Max Power Dissipation: 300mW; Max Collector Current: 200mA; Collector Emitter Saturation Voltage: 300mV; Number of Elements: 1; hFE Min: 100; Collector Base Voltage (VCBO): 60V; Emitter Base Voltage (VEBO): 6V; Contact Plating: Tin; Package Quantity: 3000; Max Frequency: 300MHz; REACH SVHC: No SVHC; Max Operating Temperature: 150°C; Width: 1.4mm; Collector Emitter Voltage (VCEO): 40V; Voltage Rating (DC): 40V; Radiation Hardening: No; Case/Package: SOT-23; Height: 1mm; Collector Emitter Breakdown Voltage: 40V; Length: 3.05mm; Polarity: NPN; Packaging: Tape and Reel; Number of Pins: 3; Min Operating Temperature: -55°C; Gain Bandwidth Product: 300MHz; Mount: Surface Mount; Weight: 0.000282oz; Continuous Collector Current: 200mA; Transition Frequency: 300MHz; Max Breakdown Voltage: 40V; Lead Free: Lead Free
R1-R6 R8-R16 R19 R25 R29 = CMP-1012-00623-3: Chip Resistor, 10 KOhm, +/- 1%, 0.1 W, -55 to 155 degC, 0603 (1608 Metric), RoHS, Tape and Reel; Manufacturer: Panasonic; Voltage Rating: 75V; Case\/Package: 0603; Power Rating: 100mW; Resistance: 10KOhm; Temperature Coefficient: 100ppm\/degreesC; Number of Pins: 2; Package Reference: 603; Depth: 0.8mm; Mount: SurfaceMount; Package Description: 2-Pin Surface Mount Device, Body 1.6 x 0.85 mm; Datasheet Version: 02/2017; Length: 1.6mm; Lead Free: LeadFree; Height: 0.45mm; Number of Terminations: 2; Max Power Dissipation: 100mW; Min Operating Temperature: -55degC; Datasheet URL: https://industrial.panasonic.com/cdbs/www-data/pdf/RDA0000/AOA0000C304.pdf; Termination: SMD/SMT; Case Code (Metric): 1608; Case Code (Imperial): 0603; Tolerance: 1%; Max Operating Temperature: 155degC; RoHSCompliant: true; Voltage Rating (DC): 75V; Radiation Hardening: No; Packaging: TapeandReel; Composition: ThickFilm; Mounting Technology: SurfaceMount; Manufacturer URL: http://www.panasonic.com/; Width: 0.031inch; REACH SVHC: NoSVHC; Contact Plating: Tin; Military Standard: Not; Package Quantity: 1
R7 R18 R24 = CMP-2001-04896-1: Manufacturer: Vishay Dale; Part Number: CRCW08050000Z0EA
R17 R20 R21 R23 R26 R27 = CMP-2100-03681-2: RES SMD 0 OHM JUMPER 1/4W 1206; Manufacturer Part Number: RC1206JR-070RL; Manufacturer: YAGEO; Voltage Rating: 200V; Temperature Coefficient: 300ppm/°C; Power Rating: 0.25W; Value: 0Ω; Tolerance: 5%; Temperature Range Low: -55°C; Category: Res; Automotive: No; Ipc Land Pattern Name: RESC310160X55; Device Class L1: Passive Components; Temperature: -55°C to +155°C; ComponentLink2URL: https://www.yageo.com/upload/media/product/productsearch/datasheet/rchip/PYu-RC_Group_51_RoHS_L_10.pdf; Lead Free: Yes; Height: 0.65mm; Footprint Url: https://www.yageo.com/upload/website/yageo_PYu-R_Mount_10_19050818_343.pdf; Package: RC1206; Digikey Description: RES SMD 0 OHM JUMPER 1/4W 1206; Temperature Range High: +155°C; Device Class L3: Chip SMD Resistors; Device Class L2: Resistors; Octopart: https://octopart.com/rc1206jr-070rl-yageo-40025601; Resistance: 0Ω; Series: RC; ComponentLink2Description: Datasheet; Composition: Thick Film; RoHS: TRUE; Mouser Description: Resistor: thick film; SMD; 1206; 0O; 0.25W; ±5%; -55÷155°C
S = OS102011MS2QN1: Slide Switch SPDT Through Hole; MF: C&K; Price: None; Availability: Unavailable; Package: None; SnapEDA_Link: https://www.snapeda.com/parts/OS102011MS2QN1/C%26K/view-part/391519/?ref=snap; MP: OS102011MS2QN1; Value: *
S1 S2 = 3-1437566-8: Switch Tactile OFF (ON) SPST Round Button Gull Wing 0.05A 12VDC 1VA 1.57N SMD Loose Piece; MF: TE Connectivity / AMP; SnapEDA_Link: https://www.snapeda.com/parts/3-1437566-8/TE%20Connectivity%20/%20AMP/view-part/292111/?ref=snap; MP: 3-1437566-8; Check_prices: https://www.snapeda.com/parts/3-1437566-8/TE%20Connectivity%20/%20AMP/view-part/292111/?ref=eda; Price: None; EU_RoHS_Compliance: Compliant; Value: *; Availability: Good; Package: SMD-6 Omron Electronics; Purchase-URL: https://pricing.snapeda.com/search/part/3-1437566-8/?ref=eda
U1 = CMP-04872-000011-1: DGTL ISO 2.5KV 2CH I2C 8SOIC; Manufacturer: Texas Instruments; Max Supply Voltage: 5.5V; Interface: I2C,SMBus,Other; Nominal Supply Current: 1.7-3.1mA; Standoff Height: 0.11mm; Max Junction Temp: +136°C; Min Supply Voltage: 3V; Ipc Land Pattern Name: SOIC127P600X175-8; Ambient Temperature Range Low: -40°C; Temperature: -40°C to +125°C; Device Class L3: unset; Mouser Description: Digital Isolators Low-Power,Bidirec I2C Iso; Manufacturer Part Number: ISO1540DR; Octopart: https://octopart.com/iso1540dr-texas+instruments-24334113; Digikey Description: DGTL ISO 2.5KV 2CH I2C 8SOIC; Category: IC; Height: 1.75mm; Ambient Temperature Range High: +125°C; RoHS: TRUE; Automotive: No; Package: D0008A; ComponentLink2URL: http://www.ti.com/lit/ds/symlink/iso1540.pdf; Device Class L2: Interface ICs; Device Class L1: Integrated Circuits (ICs); Temperature Range Low: -40°C; Lead Free: Yes; ComponentLink2Description: Datasheet; Temperature Range High: +125°C
U2 = CMP-12757-000006-1: IC REG BUCK 3.3V 2A TSOT26; Manufacturer: Diodes Inc.; Output Type: Fixed; Min Supply Voltage: 3.8V; Number Of Outputs: 1; Max Junction Temp: +160°C; Nominal Supply Current: 22uA; Standoff Height: 0.01mm; Switching Frequency: 1.1MHz; Max Supply Voltage: 32V; ComponentLink2Description: Datasheet; Device Class L1: Integrated Circuits (ICs); Temperature: to +160°C; Device Class L3: Voltage Regulators - Switching; RoHS: TRUE; Octopart: https://octopart.com/ap63203wu-7-diodes+inc.-98099550; Output Voltage: 3.3V; Lead Free: Yes; ComponentLink2URL: https://www.diodes.com/assets/Datasheets/AP63200-AP63201-AP63203-AP63205.pdf; Digikey Description: IC REG BUCK 3.3V 2A TSOT26; Footprint Url: https://www.diodes.com/assets/Package-Files/TSOT26.pdf; Ambient Temperature Range High: +85°C; Height: 1mm; Automotive: No; Temperature Range High: +160°C; Switching Topology: Buck; Output Current: 2A; Package: TSOT26; Category: IC; Mouser Description: AP63203 Series 3.3 V 2 A SMT Fixed Low IQ Synchronous Buck - TSOT-26; Device Class L2: Power Management ICs; Ambient Temperature Range Low: -40°C; Manufacturer Part Number: AP63203WU-7
U3 = CMP-2000-04952-1: High-Voltage, High-Current Darlington Transistor Array, 0.5 A, 50 V, -20 to 70 degC, 16-Pin SOIC (D16), Green (RoHS & no Sb/Br), Tube; Manufacturer: TexasInstruments; Package Version: 4040047-6/M, 06/2011; Maximum Collector Emitter Voltage: 50V; Peak DC Collector Current: 0.5A; Maximum Collector Emitter Saturation Voltage: 1.1@100mA; Configuration: Array7; Category: DarlingtonBJT; Type: NPN; Manufacturer URL: http://www.ti.com/; Package: 16SOIC; Package Description: 16-Pin Plastic Small Outline, Body 9.9 x 3.9 mm, Pitch 1.27 mm; Mounting: SurfaceMount; Package URL: http://www.ti.com/lit/ml/mpds178g/mpds178g.pdf; Packaging: Rail/Tube; Datasheet Version: Rev. O, 01/2016; Datasheet URL: http://www.ti.com/general/docs/lit/getliterature.tsp?genericPartNumber=uln2003a&fileType=pdf; Package Reference: D16
U4 = CMP-0537-00067-1: ARM Cortex-M4 32-bit MCU, 16 KB Flash, 16 KB Internal RAM, 37 I/Os, 48-Pin LQFP, -40 to 85 degC, Tray; D/A Converter: 3; Operating Frequency(F) (Processor speed) (MHz): 72; I/Os (High Current): 37; FLASH Size (Prog) (kB): 16; Supply Voltage(Vcc) min (V): 2; Packing: Tray; Core: ARM Cortex-M4; ComponentLink1URL: http://www.st.com/; DatasheetVersion: Rev. 4; Mounting Technology: Surface Mount; ComponentLink2Description: Datasheet; ComponentLink2URL: http://www.st.com/st-web-ui/static/active/en/resource/technical/document/datasheet/DM00097745.pdf; Internal RAM Size (kB): 16; Package Description: 48-Pin Low Profile Quad Flat Package, Body 7 x 7 mm, Pitch 0.5 mm; Package Reference: LQFP48; ComponentLink1Description: Manufacturer URL
U5 U6 = 4N35SM: Transistor Output Optocouplers PHOTO TRANS; MF: ON Semiconductor / Fairchild; SnapEDA_Link: https://www.snapeda.com/parts/4N35SM/Fairchild%20Semiconductor/view-part/4834122/?ref=snap; Mouser-Purchase-URL: https://snapeda.com/shop?store=Mouser&id=4834122; Availability: Good; DigiKey-Purchase-URL: https://snapeda.com/shop?store=DigiKey&id=4834122; MP: 4N35SM; Package: None; Value: *; Price: None; Arrow_Electronics-Purchase-URL: https://snapeda.com/shop?store=Arrow+Electronics&id=4834122
X1 = CMP-0277-00002-1: Low Profile Surface Mount Microprocessor Crystal, 4.096 MHz +/-30 ppm, 180 Ohm, -40 to 85 degC, 2-Pin 11.4 x 4.7 x 3.3 mm SMD, RoHS, Tape and Reel; Manufacturer: Abracon; PartNumber: ABLS2-4.096MHZ-D4Y-T; Operation Mode: Fundamental or 3rd Overtone; Shunt Capacitance: 7 pF Max.; ESR: 180 Ohm; Load Capacitance: 18 pF; Mounting Technology: Surface Mount; PackageDescription: 2-Pin SMD, Body 11.4 x 4.7 mm, Height 3.3 mm; ComponentLink1URL: http://www.abracon.com/; Freq. Stability: +/- 30 ppm; ComponentLink2Description: Datasheet; Operating Temp. Range: -40 to 85 degC; Packing: Tape and Reel; RoHS: TRUE; PackageReference: ABLS2-2; DatasheetVersion: Rev. 03.31.11; Freq. Tolerance: +/- 30 ppm; Frequency: 4.096 MHz; ComponentLink2URL: http://www.abracon.com/Resonators/ABLS2.pdf; ComponentLink1Description: Manufacturer URL